# EasyEDA Pro project Temp_Con_V116.eprj, schematic TEMP_STM32
Board Name: TEMP_STM32; Create Date: 2025-01-21; Page Name: STM32; Project Name: Temp_Con_V116; Schematic Name: TEMP_STM32; Update Date: 2025-01-28; Company: EasyEDA.com; Page Size: A4; Version: V1.0
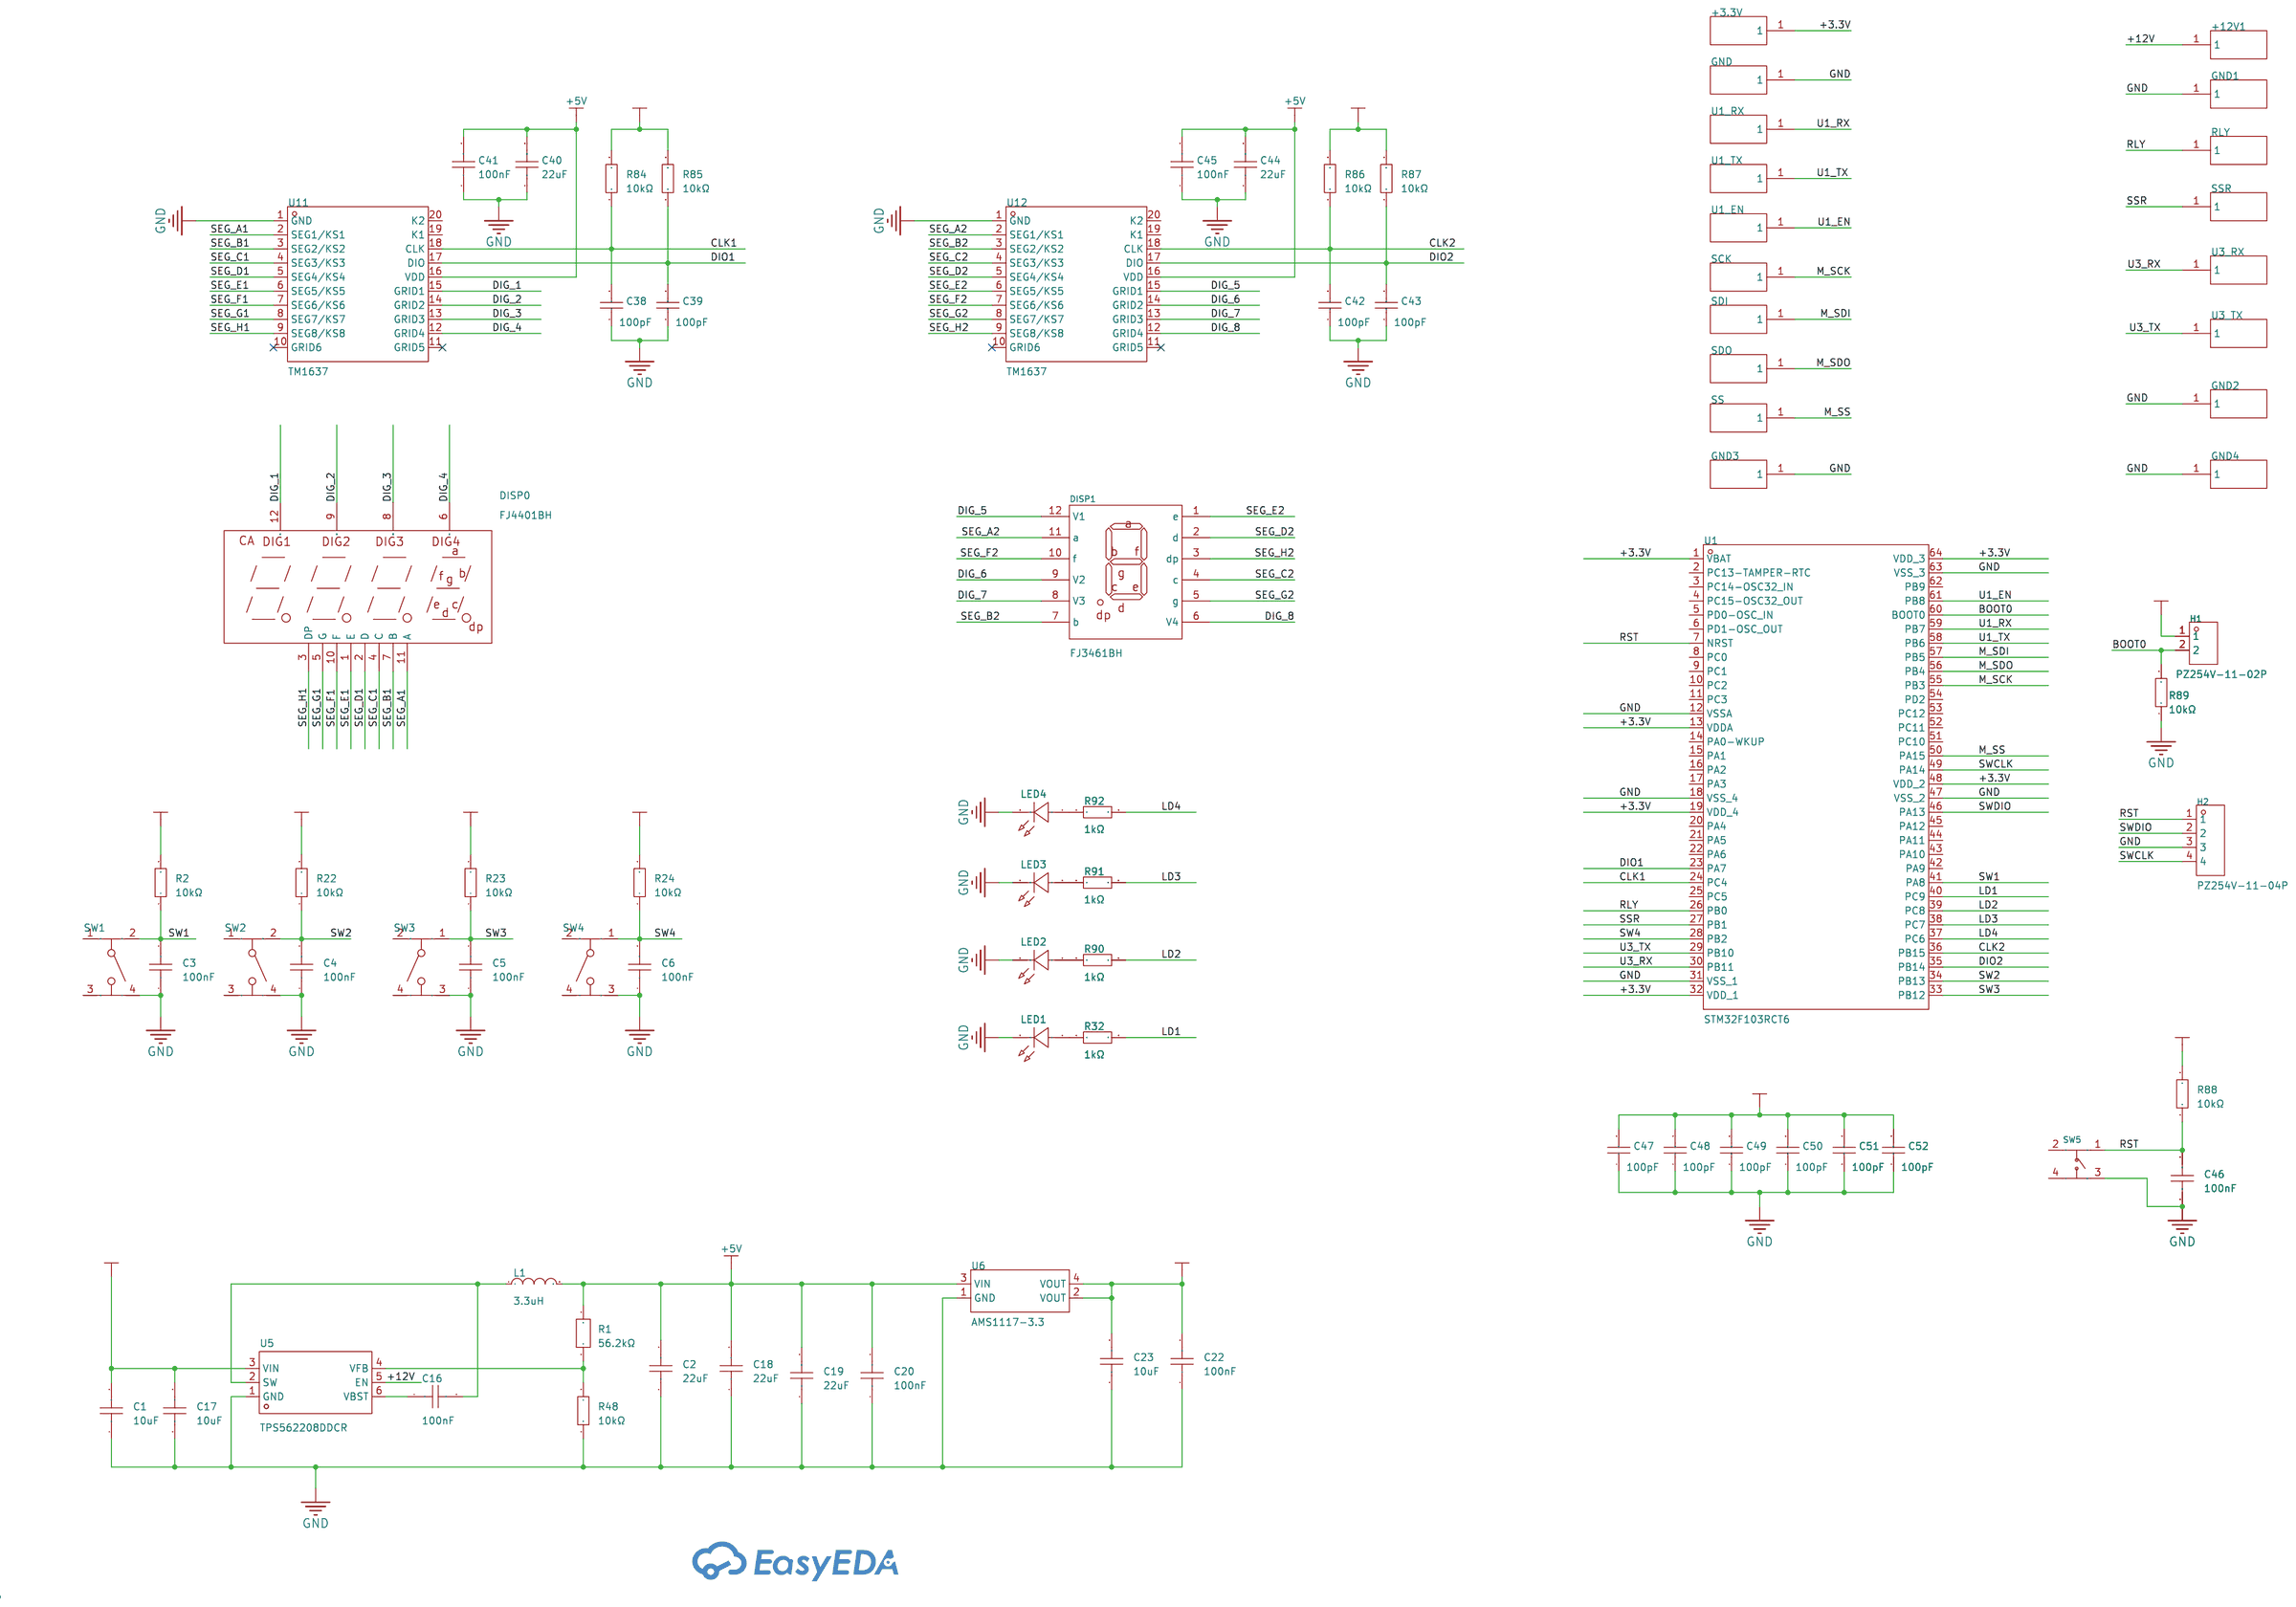
[diagram p0: schematic sheet]

## Parts
+3.3V  -  [S_FT]  (no BOM)
+12V1  -  [S_FT]  (no BOM)
C1  10uF  [C1210]
C2  22uF  [C0805]
C3  100nF  [C0805]
C4  100nF  [C0805]
C5  100nF  [C0805]
C6  100nF  [C0805]
C16  100nF  [C0805]
C17  10uF  [C1210]
C18  22uF  [C0805]
C19  22uF  [C0805]
C20  100nF  [C0805]
C22  100nF  [C0805]
C23  10uF  [C0805]
C38  100pF  [C0805]
C39  100pF  [C0805]
C40  22uF  [C0805]
C41  100nF  [C0805]
C42  100pF  [C0805]
C43  100pF  [C0805]
C44  22uF  [C0805]
C45  100nF  [C0805]
C46  100nF  [C0805]
C47  100pF  [C0805]
C48  100pF  [C0805]
C49  100pF  [C0805]
C50  100pF  [C0805]
C51  100pF  [C0805]
C52  100pF  [C0805]
DISP0  FJ4401BH  [LED-SEG-TH_12P-L40.4-W16.0-P2.54-S12.70-BL]
DISP1  FJ3461BH  [LED-SEG-TH_12P-L30.0-W13.7-P2.54-S10.16-BL]
GND  -  [S_FT]  (no BOM)
GND1  -  [S_FT]  (no BOM)
GND2  -  [S_FT]  (no BOM)
GND3  -  [S_FT]  (no BOM)
GND4  -  [S_FT]  (no BOM)
H1  PZ254V-11-02P  [HDR-TH_2P-P2.54-V-M]
H2  PZ254V-11-04P  [HDR-TH_4P-P2.54-V-M]
L1  3.3uH  [IND-SMD_L5.4-W5.2_RS0530]
LED1  XL-2012SURC  [LED0805-R-RD]
LED2  XL-2012SURC  [LED0805-R-RD]
LED3  XL-2012SURC  [LED0805-R-RD]
LED4  XL-2012SURC  [LED0805-R-RD]
R1  56.2kΩ  [R0805]
R2  10kΩ  [R0805]
R22  10kΩ  [R0805]
R23  10kΩ  [R0805]
R24  10kΩ  [R0805]
R32  1kΩ  [R0805]
R48  10kΩ  [R0805]
R84  10kΩ  [R0805]
R85  10kΩ  [R0805]
R86  10kΩ  [R0805]
R87  10kΩ  [R0805]
R88  10kΩ  [R0805]
R89  10kΩ  [R0805]
R90  1kΩ  [R0805]
R91  1kΩ  [R0805]
R92  1kΩ  [R0805]
RLY  -  [S_FT]  (no BOM)
SCK  -  [S_FT]  (no BOM)
SDI  -  [S_FT]  (no BOM)
SDO  -  [S_FT]  (no BOM)
SS  -  [S_FT]  (no BOM)
SSR  -  [S_FT]  (no BOM)
SW1  YTS1R0011FBT00  [SW-TH_4P-L6.0-W6.0-P4.50-LS6.5]
SW2  YTS1R0011FBT00  [SW-TH_4P-L6.0-W6.0-P4.50-LS6.5]
SW3  YTS1R0011FBT00  [SW-TH_4P-L6.0-W6.0-P4.50-LS6.5]
SW4  YTS1R0011FBT00  [SW-TH_4P-L6.0-W6.0-P4.50-LS6.5]
SW5  TSC005A1618A03  [KEY-SMD_4P-L5.2-W5.2-P3.70-LS6.4]
U1  STM32F103RCT6  [LQFP-64_L10.0-W10.0-P0.50-LS12.0-BL]
U1_EN  -  [S_FT]  (no BOM)
U1_RX  -  [S_FT]  (no BOM)
U1_TX  -  [S_FT]  (no BOM)
U3_RX  -  [S_FT]  (no BOM)
U3_TX  -  [S_FT]  (no BOM)
U5  TPS562208DDCR  [SOT-23-6_L2.9-W1.6-P0.95-LS2.8-BR]
U6  AMS1117-3.3  [SOT-223-3_L6.5-W3.4-P2.30-LS7.0-BR]
U11  TM1637  [SOP-20_L12.8-W7.5-P1.27-LS10.4-BL]
U12  TM1637  [SOP-20_L12.8-W7.5-P1.27-LS10.4-BL]

## Library data of the parts
+3.3V +12V1 GND GND1-GND4 RLY SCK SDI SDO SS SSR U1_EN U1_RX U1_TX U3_RX U3_TX = S_TM
C1 C17 = CS3225X7R106K500NRL: Capacitance: Voltage Rated: Temperature Coefficient:; LCSC Part Name: 10uF 50V; Supplier Part: C2918502; Manufacturer: SAMWHA(三和); Supplier Footprint: 1210; JLCPCB Part Class: Extended Part; Datasheet: https://atta.szlcsc.com/upload/public/pdf/source/20230815/D6EC8E8D4948B4151F2C89DF2FF24A45.pdf; Supplier: LCSC
C2 C18 C19 C40 C44 = GRM21BZ71A226ME15L: Capacitance: Tolerance:±20% Tolerance:±20% Voltage Rated: Temperature Coefficient:; LCSC Part Name: 22uF ±20% 10V; Supplier Part: C907991; Manufacturer: muRata(村田); Supplier Footprint: 0805; JLCPCB Part Class: Extended Part; Datasheet: https://atta.szlcsc.com/upload/public/pdf/source/20201022/C907991_FDD26F97C89A3C2FF3DDCDE25DF37A4B.pdf; Supplier: LCSC; Tolerance: ±20%
C3-C6 C16 C20 C22 C41 C45 C46 = CC0805KRX7R9BB104: Capacitance: Tolerance:±10% Tolerance:±10% Voltage Rated: Temperature Coefficient:; LCSC Part Name: 100nF ±10% 50V; Supplier Part: C49678; Manufacturer: YAGEO(国巨); Supplier Footprint: 0805; JLCPCB Part Class: Basic Part; Datasheet: https://atta.szlcsc.com/upload/public/pdf/source/20180224/C181747_15194369449651363981.pdf; Supplier: LCSC; Tolerance: ±10%
C23 = GRM21BR61C106KE15L: Capacitance: Tolerance:±10% Tolerance:±10% Voltage Rated: Temperature Coefficient:; LCSC Part Name: 10uF ±10% 16V; Supplier Part: C77075; Manufacturer: muRata(村田); Supplier Footprint: 0805; JLCPCB Part Class: Extended Part; Datasheet: https://atta.szlcsc.com/upload/public/pdf/source/20200305/C490387_23319AE8C154DEB24C505E6C82A8106A.pdf; Supplier: LCSC; Tolerance: ±10%
C38 C39 C42 C43 C47-C52 = CC0805KRX7R9BB101: LCSC Part Name: 100pF ±10% 50V; Supplier Part: C107140; Manufacturer: YAGEO(国巨); Supplier Footprint: 0805; JLCPCB Part Class: Extended Part; Datasheet: https://atta.szlcsc.com/upload/public/pdf/source/20170914/C128857_1505359892143968080.pdf; Supplier: LCSC; Tolerance: ±10%; Check: true
DISP0 = FJ4401BH: LCSC Part Name: 4位0.4英寸红色数码管 共阳极; Supplier Part: C10712; Manufacturer: 志浩; Supplier Footprint: 插件; JLCPCB Part Class: Extended Part; Datasheet: https://atta.szlcsc.com/upload/public/pdf/source/20170217/1487301558617.pdf; Supplier: LCSC; Number of Characters: 4Bit; Luminous Color: Red; LED Polarity: 共阳极; Digit/Alpha Size(inch): 0.4; Check: true
DISP1 = FJ3461BH: LCSC Part Name: 4位0.36英寸红色数码管 共阳极; Supplier Part: C10711; Manufacturer: 志浩; Supplier Footprint: 插件; JLCPCB Part Class: Extended Part; Datasheet: https://atta.szlcsc.com/upload/public/pdf/source/20220902/FD133BFB940A68D1DA44926249782EAE.pdf; Supplier: LCSC; Number of Characters: 4Bit; Luminous Color: Red; LED Polarity: 共阳极; Digit/Alpha Size(inch): 0.36; Check: true
H1 = PZ254V-11-02P: LCSC Part Name: 间距:2.54mm 1x2P 直插 方针; Supplier Part: C492401; Manufacturer: XFCN(兴飞); Supplier Footprint: 插件,P=2.54mm; JLCPCB Part Class: Extended Part; Datasheet: https://atta.szlcsc.com/upload/public/pdf/source/20200309/C492401_A812433581A9B211A7FFA413ADDFF0E5.pdf; Supplier: LCSC; Pin Structure: 1x2P; Pitch: 2.54mm; Circluar Pins/Square Pins: Square Pins; Mounting Type: Straight; Number of Rows: Plugin; Number of Pins: 2P; Length of Mating Pin: 6mm; Insulation Height: 2.5mm; Length of End Connection Pin: 3mm; Operating Temperature Range: -40℃~+105℃; Color: Black; Check: true
H2 = PZ254V-11-04P: LCSC Part Name: 间距:2.54mm 1x4P 直插 方针; Supplier Part: C2691448; Manufacturer: XFCN(兴飞); Supplier Footprint: 插件,P=2.54mm; JLCPCB Part Class: Extended Part; Datasheet: https://atta.szlcsc.com/upload/public/pdf/source/20200309/C492403_F9F19131791D08044AD4F84F8E751A34.pdf; Supplier: LCSC; Pin Structure: 1x4P; Pitch: 2.54mm; Circluar Pins/Square Pins: Square Pins; Mounting Type: Straight; Number of Rows: Plugin; Number of Pins: 4P; Current Rating (Max): 3A; Voltage Rating (Max): 250V; Length of Mating Pin: 6mm; Insulation Height: 2.5mm; Length of End Connection Pin: 3mm; Operating Temperature Range: -40℃~+105℃; Color: Black; Check: true
L1 = RS0530-3R3MS: LCSC Part Name: 一体成型贴片电感; Supplier Part: C32712971; Manufacturer: Ruishen(瑞申电子); Supplier Footprint: SMD,5.4x5.2mm; JLCPCB Part Class: Extended Part; Datasheet: https://atta.szlcsc.com/upload/public/pdf/source/20240725/7B6EBB1A494949AC693F8F7680A8A98C.pdf; Supplier: LCSC; Tolerance: ±20%; Current - Saturation (Isat): 6A; Type: Integrated molded inductor; Check: true
LED1-LED4 = XL-2012SURC: Supplier Part: C965812; Manufacturer: XINGLIGHT(成兴光); Supplier Footprint: 0805; JLCPCB Part Class: Extended Part; Datasheet: https://atta.szlcsc.com/upload/public/pdf/source/20221102/49E1A0A365644091E6270AF1C5E0FE37.pdf; Supplier: LCSC; Emitted Color: Red; Power Dissipation: 55mW; Forward Current: 25mA; Dominant Wavelength: 617nm~621nm; Peak Wavelength: 623nm; Lens Color: 无色透明透镜; Viewing Angle: 120°; Mounting Sytle: Positive post; Operating Temperature: -30℃~+85℃; Check: true
R1 = RC0805FR-0756K2L: Type:Thick Film Resistors Resistance: Tolerance:±1% Tolerance:±1% Power(Watts): Overload Voltage (Max): Temperature Coefficient:±100ppm/℃ Temperature Coefficient:±100ppm/℃ Operating Temperature Range:-55℃~+155℃ Operating Temperature Range:-55℃~+155℃; LCSC Part Name: 厚膜电阻 56.2kΩ ±1% 125mW; Supplier Part: C483186; Manufacturer: YAGEO(国巨); Supplier Footprint: 0805; JLCPCB Part Class: Extended Part; Datasheet: https://atta.szlcsc.com/upload/public/pdf/source/20200715/C483186_14A403F9F116408ECE91659475C66891.pdf; Supplier: LCSC; Type: Thick Film Resistors; Tolerance: ±1%; Temperature Coefficient: ±100ppm/℃; Operating Temperature Range: -55℃~+155℃
R2 R22-R24 R48 R84-R89 = RC0805FR-0710KL: Type:Thick Film Resistors Resistance: Tolerance:±1% Tolerance:±1% Power(Watts): Overload Voltage (Max): Temperature Coefficient:±100ppm/℃ Temperature Coefficient:±100ppm/℃ Operating Temperature Range:-55℃~+155℃ Operating Temperature Range:-55℃~+155℃; LCSC Part Name: 厚膜电阻 10kΩ ±1% 125mW; Supplier Part: C84376; Manufacturer: YAGEO(国巨); Supplier Footprint: 0805; JLCPCB Part Class: Extended Part; Datasheet: https://atta.szlcsc.com/upload/public/pdf/source/20170708/1499509500945.pdf; Supplier: LCSC; Type: Thick Film Resistors; Tolerance: ±1%; Temperature Coefficient: ±100ppm/℃; Operating Temperature Range: -55℃~+155℃
R32 R90-R92 = RC0805FR-071KL: Type:Thick Film Resistors Resistance: Tolerance:±1% Tolerance:±1% Power(Watts): Overload Voltage (Max): Temperature Coefficient:±100ppm/℃ Temperature Coefficient:±100ppm/℃ Operating Temperature Range:-55℃~+155℃ Operating Temperature Range:-55℃~+155℃; LCSC Part Name: 厚膜电阻 1kΩ ±1% 125mW; Supplier Part: C95781; Manufacturer: YAGEO(国巨); Supplier Footprint: 0805; JLCPCB Part Class: Extended Part; Datasheet: https://atta.szlcsc.com/upload/public/pdf/source/20170708/1499509500945.pdf; Supplier: LCSC; Type: Thick Film Resistors; Tolerance: ±1%; Temperature Coefficient: ±100ppm/℃; Operating Temperature Range: -55℃~+155℃
SW1-SW4 = YTS1R0011FBT00: LCSC Part Name: 6*6*7mm 直插 轻触开关; Supplier Part: C5274850; Manufacturer: YIYUAN(怡远); Supplier Footprint: 插件,6x6mm; JLCPCB Part Class: Extended Part; Datasheet: https://atta.szlcsc.com/upload/public/pdf/source/20220421/61F3B92F713CB3CB2E64126F4B7263E8.pdf; Supplier: LCSC; Circuit: SPST; Actuator Style: Round Button; Operating Force: 160gf; Mounting Style: Straight; Switch Length: 6mm; Switch Width: 6mm; Switch Height: 7mm; Contact Current: 50mA; Voltage Rating (DC): 12V; Check: true
SW5 = TSC005A1618A03: LCSC Part Name: 5.2*5.2*1.6mm 立贴 轻触开关; Supplier Part: C2888970; Manufacturer: BZCN(博众电气); Supplier Footprint: SMD; JLCPCB Part Class: Extended Part; Datasheet: https://atta.szlcsc.com/upload/public/pdf/source/20210906/01FFDC78BE53EEB6057D5EB219EA4B81.pdf; Supplier: LCSC; Actuator Style: Round Button; Operating Force: 180gf; Mounting Style: Brick nogging; Switch Length: 5.2mm; Switch Width: 5.2mm; Switch Height: 1.6mm; Contact Current: 50mA; Voltage Rating (DC): 12V; Check: true
U1 = STM32F103RCT6: LCSC Part Name: 主流增强型ARM Cortex-M3 MCU，具有256 KB Flash、72 MHz CPU、电机控制、USB和CAN; Supplier Part: C8323; Manufacturer: ST(意法半导体); Supplier Footprint: LQFP-64(10x10); JLCPCB Part Class: Extended Part; Datasheet: https://atta.szlcsc.com/upload/public/pdf/source/20180207/C88442_15179953708671359491.pdf; Supplier: LCSC; CPU Core: ARM-M3; CPU Maximum Speed: 72MHz; Program Storage Size: 256KB; Program Memory Type: FLASH; Number of I/O: 51; ADC (Bit): 12bit; DAC (Bit): 12bit; Low Voltage Detection Threshold: 2V~3.6V; Check: true
U5 = TPS562208DDCR: LCSC Part Name: 2A同步降压稳压器; Supplier Part: C91301; Manufacturer: TI(德州仪器); Supplier Footprint: SOT-6; JLCPCB Part Class: Extended Part; Datasheet: https://www.ti.com/cn/lit/gpn/tps562208; Supplier: LCSC; Function: Step-down type; Output Type: Adjustable; Input Voltage: 4.5V~17V; Output Voltage: 760mV~7V; Output Current: 2A; Switching Frequency: 580kHz; Operating Temperature: -40℃~+125℃; Synchronous Rectification: Yes; Number of Outputs: 1; Topology: Step-down; Quiescent Current (Iq): 10uA; Switch tube (built-in/external): Built-in; Check: true
U6 = AMS1117-3.3_C6068481: Supplier Part: C6068481; Manufacturer: GOODWORK(固得沃克); Supplier Footprint: SOT-223; JLCPCB Part Class: Extended Part; Datasheet: https://atta.szlcsc.com/upload/public/pdf/source/20231204/C23476F5DA59EE6A049129A6E347275A.pdf; Supplier: LCSC; Output Type: Fixed; Maximum Input Voltage: 18V; Output Voltage: 3.3V; Output Current: 1A; Power Supply Rejection Ratio (PSRR): 70dB@(120Hz); Feature: Thermal Protection(TSD); Operating Temperature: -40℃~+125℃@(Tj); Output Polarity: Positive electrode; Number of Outputs: 1; Check: true
U11 U12 = TM1637: Supplier Part: C2962580; Manufacturer: TM(天微); Supplier Footprint: SOP-20-300mil; JLCPCB Part Class: Extended Part; Datasheet: https://atta.szlcsc.com/upload/public/pdf/source/20140301/1457707001239.pdf; Supplier: LCSC; Check: true

## Nets
+3.3V: +3.3V.1 C22.2 C23.2 C47.2 C48.2 C49.2 C50.2 C51.2 C52.2 H1.1 R2.2 R22.2 R23.2 R24.2 R84.2 R85.2 R86.2 R87.2 R88.2 U1.1(VBAT) U1.13(VDDA) U1.19(VDD_4) U1.32(VDD_1) U1.48(VDD_2) U1.64(VDD_3) U6.2(VOUT) U6.4(VOUT)
+5V: C2.2 C18.2 C19.2 C20.2 C40.2 C41.2 C44.2 C45.2 L1.2 R1.1 U6.3(VIN) U11.16(VDD) U12.16(VDD)
+12V: +12V1.1 C1.2 C17.2 U5.3(VIN) U5.5(EN)
GND: C1.1 C2.1 C3.1 C4.1 C5.1 C6.1 C17.1 C18.1 C19.1 C20.1 C22.1 C23.1 C38.1 C39.1 C40.1 C41.1 C42.1 C43.1 C44.1 C45.1 C46.1 C47.1 C48.1 C49.1 C50.1 C51.1 C52.1 GND.1 GND1.1 GND2.1 GND3.1 GND4.1 H2.3 LED1.2(K) LED2.2(K) LED3.2(K) LED4.2(K) R48.1 R89.1 SW1.4 SW2.4 SW3.3 SW4.3 SW5.3 U1.12(VSSA) U1.18(VSS_4) U1.31(VSS_1) U1.47(VSS_2) U1.63(VSS_3) U5.1(GND) U6.1(GND) U11.1(GND) U12.1(GND)
BOOT0: H1.2 R89.2 U1.60(BOOT0)
CLK1: C38.2 R84.1 U1.24(PC4) U11.18(CLK)
CLK2: C42.2 R86.1 U1.36(PB15) U12.18(CLK)
DIG_1: DISP0.12(DIG1) U11.15(GRID1)
DIG_2: DISP0.9(DIG2) U11.14(GRID2)
DIG_3: DISP0.8(DIG3) U11.13(GRID3)
DIG_4: DISP0.6(DIG4) U11.12(GRID4)
DIG_5: DISP1.12(V1) U12.15(GRID1)
DIG_6: DISP1.9(V2) U12.14(GRID2)
DIG_7: DISP1.8(V3) U12.13(GRID3)
DIG_8: DISP1.6(V4) U12.12(GRID4)
DIO1: C39.2 R85.1 U1.23(PA7) U11.17(DIO)
DIO2: C43.2 R87.1 U1.35(PB14) U12.17(DIO)
LD1: R32.2 U1.40(PC9)
LD2: R90.2 U1.39(PC8)
LD3: R91.2 U1.38(PC7)
LD4: R92.2 U1.37(PC6)
M_SCK: SCK.1 U1.55(PB3)
M_SDI: SDI.1 U1.57(PB5)
M_SDO: SDO.1 U1.56(PB4)
M_SS: SS.1 U1.50(PA15)
RLY: RLY.1 U1.26(PB0)
RST: C46.2 H2.1 R88.1 SW5.1 U1.7(NRST)
SEG_A1: DISP0.11(A) U11.2(SEG1/KS1)
SEG_A2: DISP1.11(a) U12.2(SEG1/KS1)
SEG_B1: DISP0.7(B) U11.3(SEG2/KS2)
SEG_B2: DISP1.7(b) U12.3(SEG2/KS2)
SEG_C1: DISP0.4(C) U11.4(SEG3/KS3)
SEG_C2: DISP1.4(c) U12.4(SEG3/KS3)
SEG_D1: DISP0.2(D) U11.5(SEG4/KS4)
SEG_D2: DISP1.2(d) U12.5(SEG4/KS4)
SEG_E1: DISP0.1(E) U11.6(SEG5/KS5)
SEG_E2: DISP1.1(e) U12.6(SEG5/KS5)
SEG_F1: DISP0.10(F) U11.7(SEG6/KS6)
SEG_F2: DISP1.10(f) U12.7(SEG6/KS6)
SEG_G1: DISP0.5(G) U11.8(SEG7/KS7)
SEG_G2: DISP1.5(g) U12.8(SEG7/KS7)
SEG_H1: DISP0.3(DP) U11.9(SEG8/KS8)
SEG_H2: DISP1.3(dp) U12.9(SEG8/KS8)
SSR: SSR.1 U1.27(PB1)
SW1: C3.2 R2.1 SW1.2 U1.41(PA8)
SW2: C4.2 R22.1 SW2.2 U1.34(PB13)
SW3: C5.2 R23.1 SW3.1 U1.33(PB12)
SW4: C6.2 R24.1 SW4.1 U1.28(PB2)
SWCLK: H2.4 U1.49(PA14)
SWDIO: H2.2 U1.46(PA13)
U1_EN: U1.61(PB8) U1_EN.1
U1_RX: U1.59(PB7) U1_RX.1
U1_TX: U1.58(PB6) U1_TX.1
U3_RX: U1.30(PB11) U3_RX.1
U3_TX: U1.29(PB10) U3_TX.1
$1N5723: C16.2 L1.1 U5.2(SW)
$1N5726: C16.1 U5.6(VBST)
$1N5728: R1.2 R48.2 U5.4(VFB)
$1N10529: LED1.1(A) R32.1
$1N10623: LED2.1(A) R90.1
$1N10717: LED3.1(A) R91.1
$1N10811: LED4.1(A) R92.1

Not connected (* = marked no-connect by the designer): SW1 1 3; SW2 1 3; SW3 2 4; SW4 2 4; SW5 2 4; U1 2(PC13-TAMPER-RTC) 3(PC14-OSC32_IN) 4(PC15-OSC32_OUT) 5(PD0-OSC_IN) 6(PD1-OSC_OUT) 8(PC0) 9(PC1) 10(PC2) 11(PC3) 14(PA0-WKUP) 15(PA1) 16(PA2) 17(PA3) 20(PA4) 21(PA5) 22(PA6) 25(PC5) 42(PA9) 43(PA10) 44(PA11) 45(PA12) 51(PC10) 52(PC11) 53(PC12) 54(PD2) 62(PB9); U11 10(GRID6)* 11(GRID5)* 19(K1) 20(K2); U12 10(GRID6)* 11(GRID5)* 19(K1) 20(K2)
